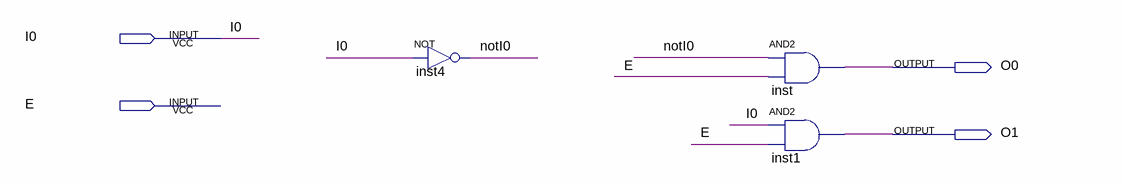
[diagram p0: schematic sheet]
// Quartus schematic DC1_2.bdf as structural Verilog: 3 symbols, 4 pins
module DC1_2 (
  input  I0,
  input  E,
  output O0,
  output O1
);

  wire notI0;

  not inst4 (notI0, I0);
  and inst (O0, notI0, E);
  and inst1 (O1, I0, E);
endmodule
